# Altium schematic sheet LEDs.SchDoc
size A; SheetNumber: 1; SheetTotal: 1
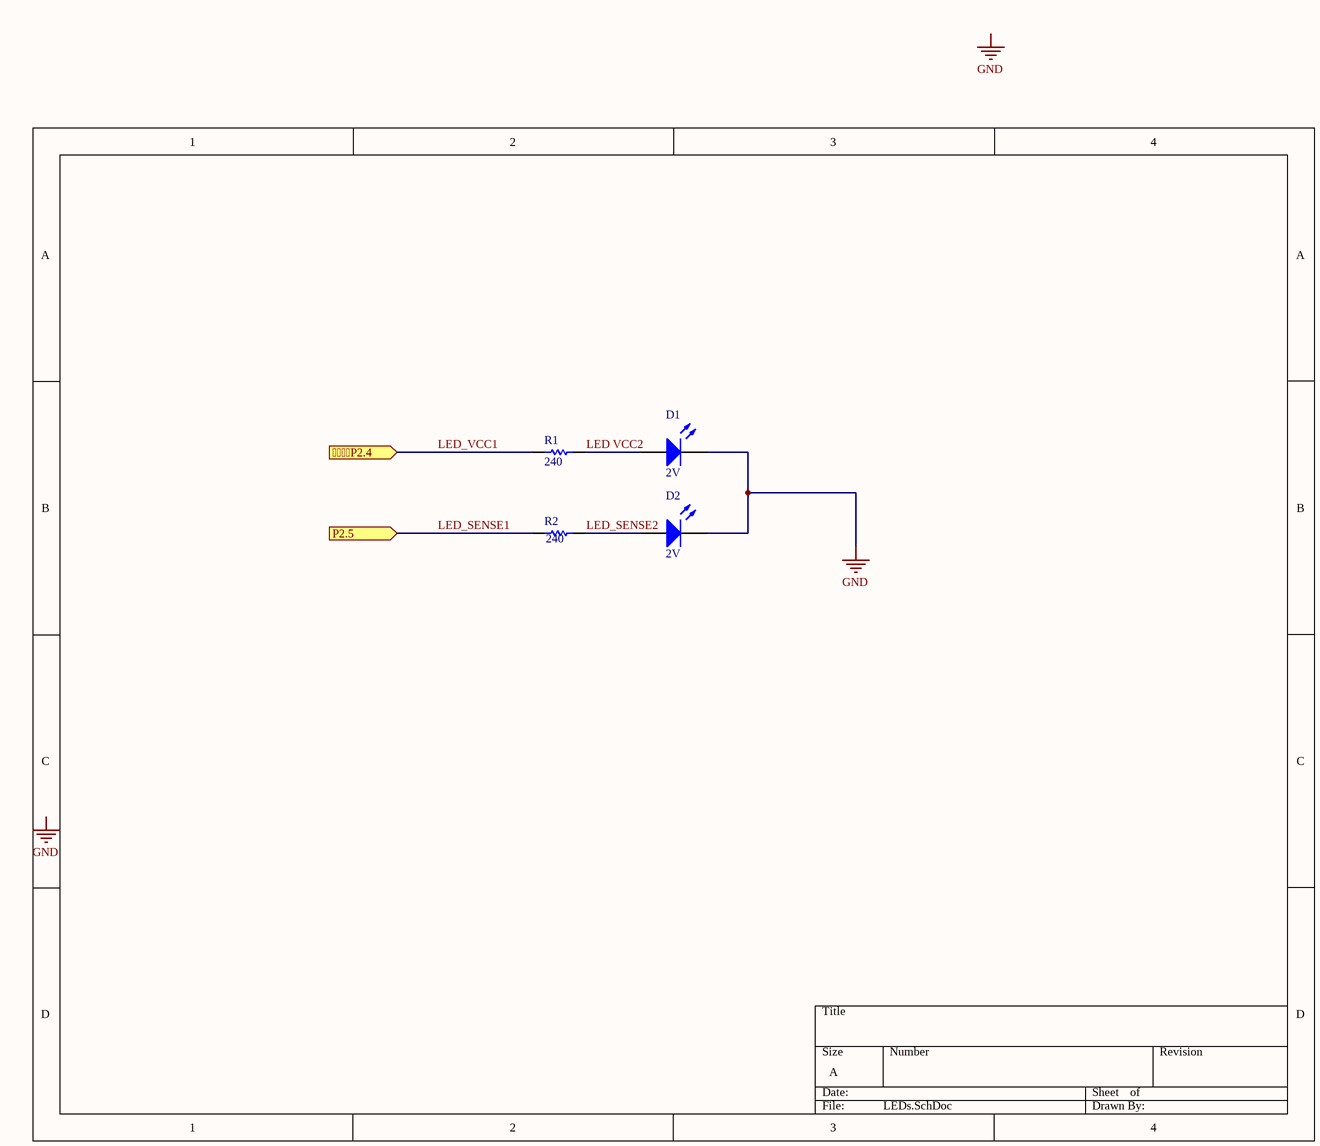
[diagram p0: LEDs.SchDoc]

## Parts
D1  2V  [0805_A]
D2  2V  [0805_A]
R1  240  [RESC2013X70X40NL20T20]
R2  240  [RESC2013X70X40NL20T20]

## Ports
P2.4 (in), P2.5 (in)

## Nets
GND: D1.1(K) D2.1(K)
LED VCC2: D1.2(A) R1.2
LED_SENSE1: R2.1 ; port P2.5
LED_SENSE2: D2.2(A) R2.2
LED_VCC1: R1.1 ; port P2.4

## Notes on the sheet
- Labels drawn without touching a wire or pin: GND

## Library data of the parts
D1 D2 = CMP-1426-00009-1: SMD mono-color Chip LED, WL-SMCW, Bright Green; PartNumber: 150080VS75000; Manufacturer: Wuerth Elektronik; ComponentLink1Description: Manufacturer URL; Color: Bright Green; PackageReference: 0805_A; ComponentLink1URL: http://www.we-online.com; ComponentLink2Description: Datasheet; ComponentLink2URL: http://katalog.we-online.com/led/datasheet/150080VS75000.pdf
R1 R2 = CMP-2001-00524-1: Part Number: ERJ-6ENF2400V; Manufacturer: Panasonic